# EAGLE board breakout (EAGLE 8.3.2), part 1 of 2
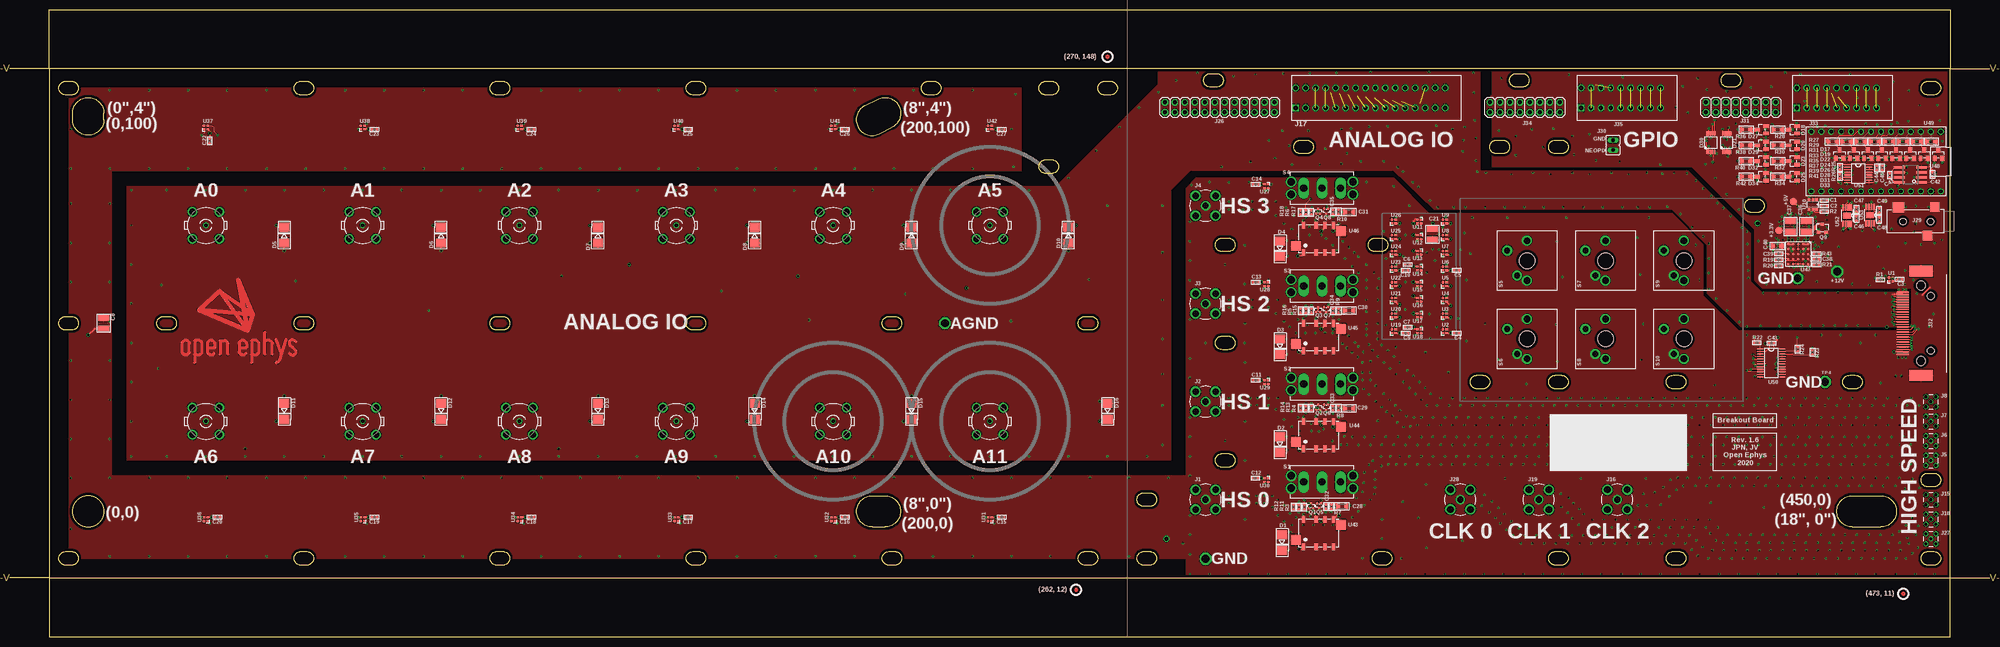
[diagram p5: board, top side]
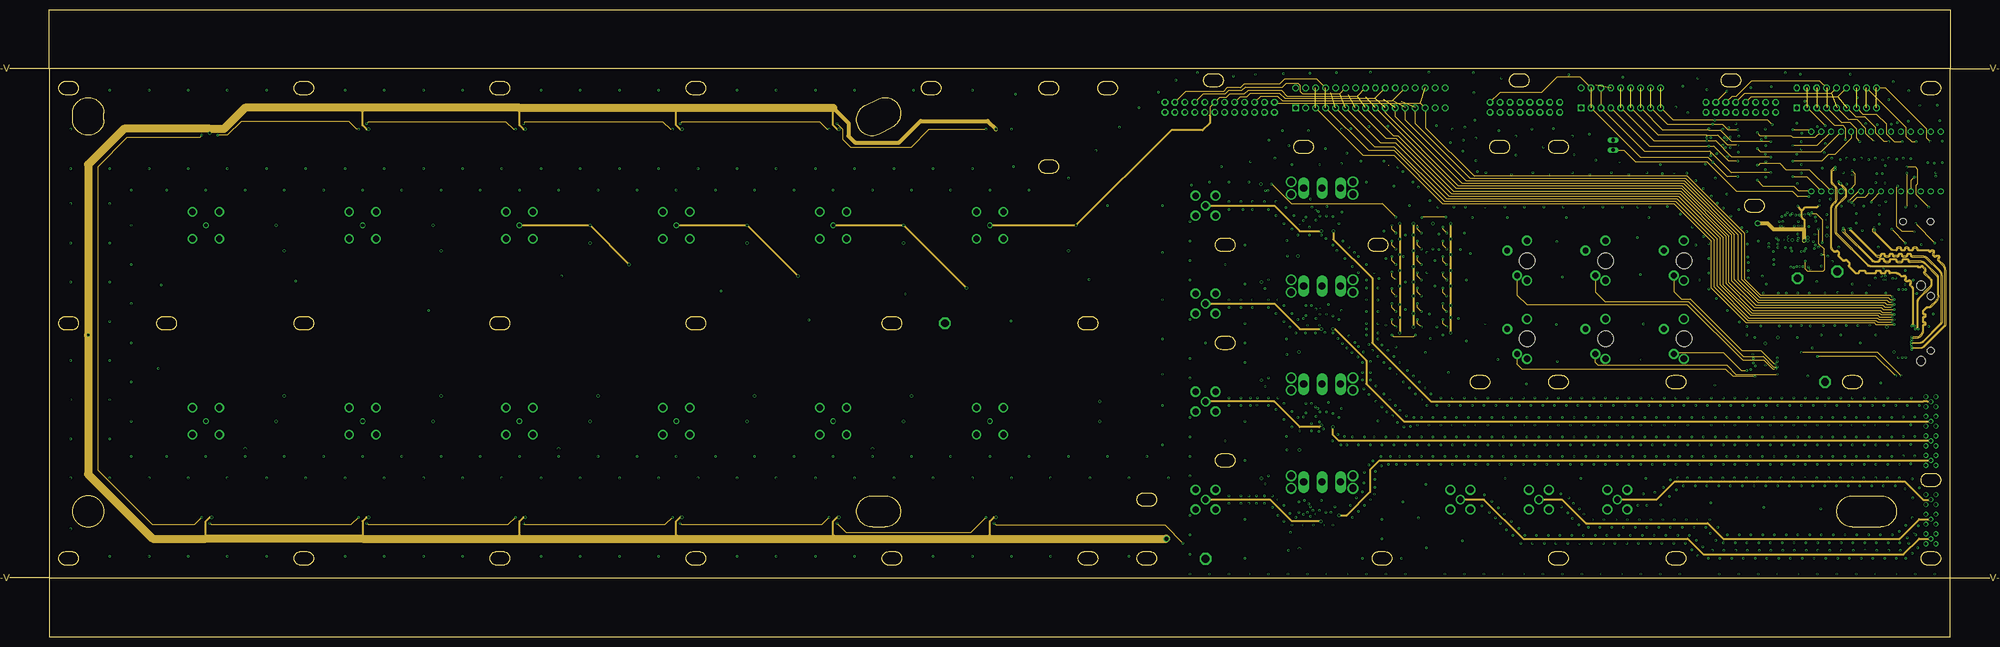
[diagram p6: board, inner layer HighSpeed]
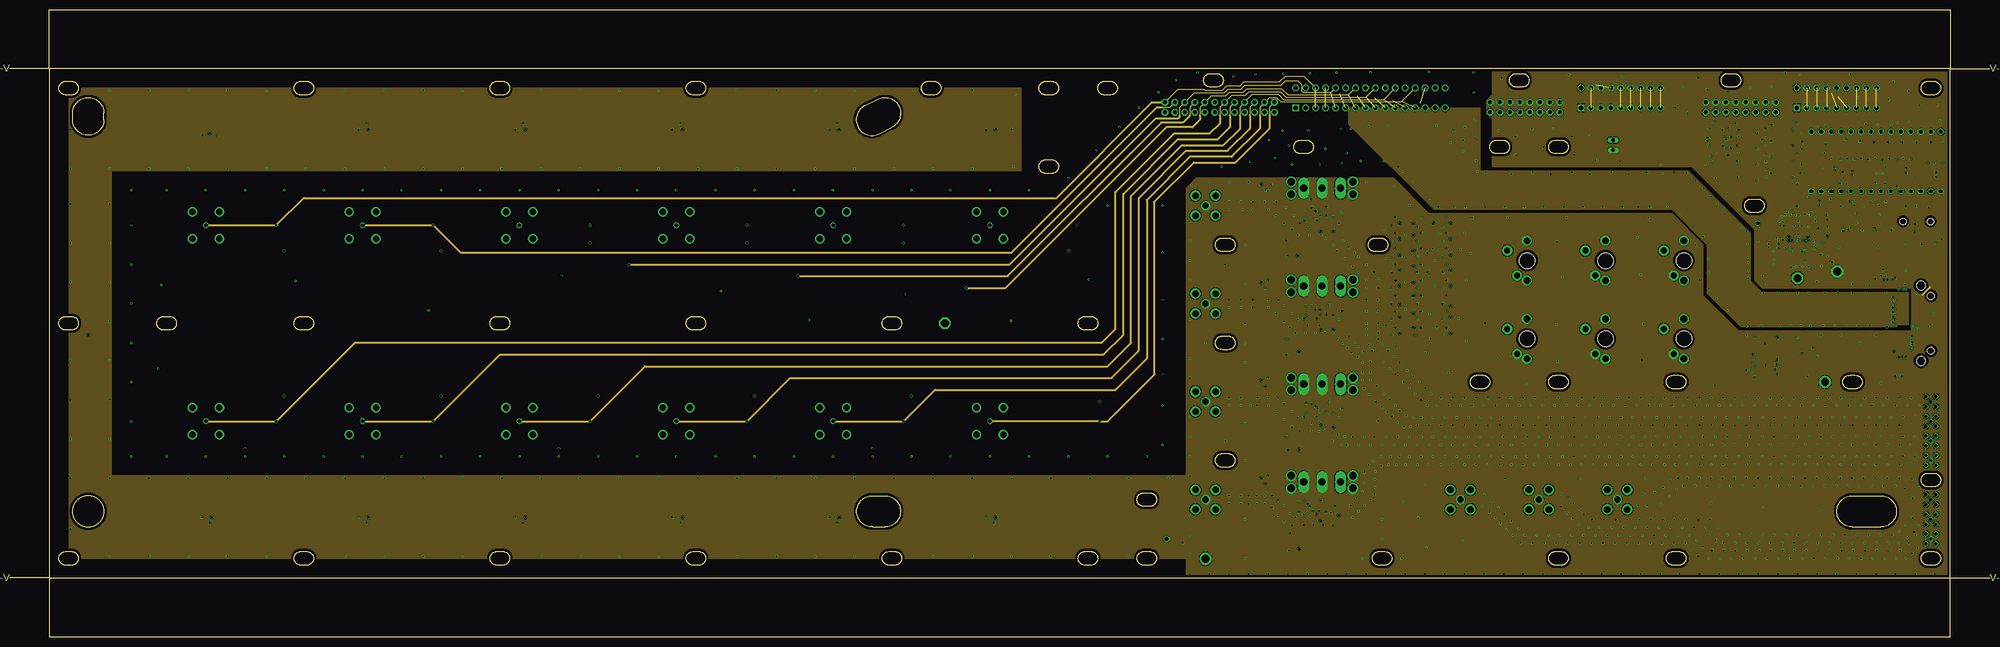
[diagram p7: board, inner layer GND2]
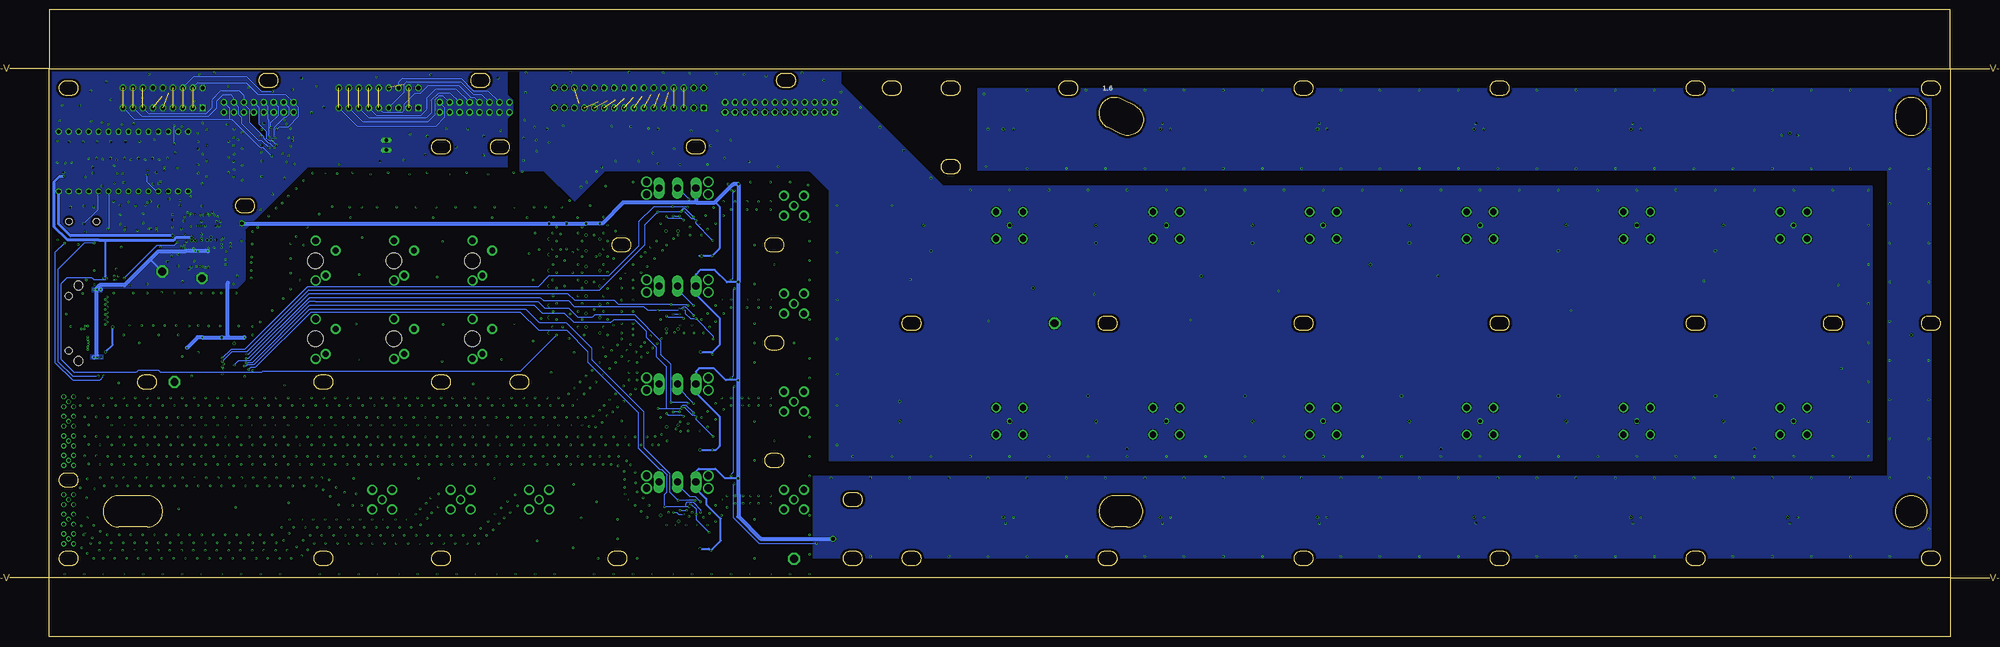
[diagram p8: board, bottom side, seen from below]

Size 505 x 160 mm. Coordinates in mm from the lower left corner, seen from the top.
Outline: 294 segments
Outline: circle at 20,32 radius 4
Copper layers (1+2*3+16): GND1 0.035mm / dielectric 0.2mm / HighSpeed 0.0175mm / dielectric 1.065mm / GND2 0.0356mm / dielectric 0.2007mm / LowSpeed 0.035mm
Design rules "jlcpcb-4-layer_JLC7628-stackup *": minimum track width 0.19mm, minimum drill 0.2mm, track to track 3.5mil, track to pad 0.1mm, pad to pad 0.1mm, via to via 0.1mm, smd to smd 0mil, copper to edge 0.7mm, drill to drill 5mil, minimum pad ring 4mil, minimum via ring 4mil, stop-mask expansion 3mil, vias tented up to drill 100mil, thermal gap 10mil
Net classes: 1 stripline: width 0.48 mm, drill 0.5 mm, clearance 0.1 mm; 3 100 Ohm Diff Mid: width 0.19 mm, drill 0.3 mm, clearance 0.09 mm
tKeepout: area 408.9,121 to 424.9,129

## Footprints (pad centres in the part's own frame; a part is rotated, then mirrored left to right if it is on the bottom)
0402 = smd 0.686 x 0.762: 1 -0.533,0; 2 0.533,0
1210 = smd 1.651 x 2.794: 1 -1.397,0; 2 1.397,0
0805 = smd 0.965 x 1.524: 1 -1.041,0; 2 1.041,0
SMA-DO214AC = smd 2.3 x 2.5: A -2,0; C 2,0
SOT23 = smd 1 x 1.4: 1 -0.95,-1.1; 2 0.95,-1.1; 3 0,1.1
MSOP-10-3X3 = smd 1.1 x 0.29: 1 -2.35,1; 2 -2.35,0.5; 3 -2.35,0; 4 -2.35,-0.5; 5 -2.35,-1; 6 2.35,-1; 7 2.35,-0.5; 8 2.35,0; 9 2.35,0.5; 10 2.35,1
SMA_JACK_142-0701-201 = drill 1.575: CLK 0,0 | drill 1.702: GND$1 -2.54,2.54; GND$2 2.54,2.54; GND$3 -2.54,-2.54; GND$4 2.54,-2.54
MMCX-THRU = drill 0.8: GND@1 -1.27,1.27; GND@2 -1.27,-1.27; GND@3 1.27,-1.27; GND@4 1.27,1.27; SIG 0,0
0731010360 = drill 0.9: 1 0,0 | drill 1.6: 2 3.43,3.43; 3 -3.43,3.43; 4 -3.43,-3.43; 5 3.43,-3.43
SCREW16-2 = drill 1.1 square: 1 0,0 | drill 1.1 octagon: 2 2.54,0; 3 5.08,0; 4 7.62,0; 5 10.16,0; 6 12.7,0; 7 15.24,0; 8 17.78,0; 9 20.32,0; 10 22.86,0; 11 25.4,0; 12 27.94,0; 13 30.48,0; 14 33.02,0; 15 35.56,0; 16 38.1,0; 17 0,5.08; 18 2.54,5.08; 19 5.08,5.08; 20 7.62,5.08; 21 10.16,5.08; 22 12.7,5.08; 23 15.24,5.08; 24 17.78,5.08; 25 20.32,5.08; 26 22.86,5.08; 27 25.4,5.08; 28 27.94,5.08; 29 30.48,5.08; 30 33.02,5.08; 31 35.56,5.08; 32 38.1,5.08
2X12-BIG = drill 1.016 pad 1.676 octagon: 1 -13.97,-1.17; 2 -13.97,1.37; 3 -11.43,-1.17; 4 -11.43,1.37; 5 -8.89,-1.17; 6 -8.89,1.37; 7 -6.35,-1.17; 8 -6.35,1.37; 9 -3.81,-1.17; 10 -3.81,1.37; 11 -1.27,-1.17; 12 -1.27,1.37; 13 1.27,-1.17; 14 1.27,1.37; 15 3.81,-1.17; 16 3.81,1.37; 17 6.35,-1.17; 18 6.35,1.37; 19 8.89,-1.17; 20 8.89,1.37; 21 11.43,-1.17; 22 11.43,1.37; 23 13.97,-1.17; 24 13.97,1.37
35RASMT2BHNTRX = smd 2.4 x 2.55: 1 0.8,3.675; 5 -1.1,-3.675 | smd 2.9 x 2.75: 4 8.2,-3.575 | hole 1.6: 0,0; 7,0
JP2 = drill 0.914 long: 1 0,0; 2 2.54,0
2X08-BIG = drill 1.016 pad 1.676 octagon: 1 -8.89,-1.17; 2 -8.89,1.37; 3 -6.35,-1.17; 4 -6.35,1.37; 5 -3.81,-1.17; 6 -3.81,1.37; 7 -1.27,-1.17; 8 -1.27,1.37; 9 1.27,-1.17; 10 1.27,1.37; 11 3.81,-1.17; 12 3.81,1.37; 13 6.35,-1.17; 14 6.35,1.37; 15 8.89,-1.17; 16 8.89,1.37
12226-82X0-00XX = smd 0.335 x 3: 1 7.938,7.2; 2 6.668,7.2; 3 5.397,7.2; 4 4.128,7.2; 5 2.857,7.2; 6 1.587,7.2; 7 0.318,7.2; 8 -0.953,7.2; 9 -2.223,7.2; 10 -3.493,7.2; 11 -4.763,7.2; 12 -6.032,7.2; 13 -7.303,7.2; 14 7.303,7.2; 15 6.032,7.2; 16 4.763,7.2; 17 3.493,7.2; 18 2.223,7.2; 19 0.953,7.2; 20 -0.318,7.2; 21 -1.587,7.2; 22 -2.857,7.2; 23 -4.128,7.2; 24 -5.397,7.2; 25 -6.668,7.2; 26 -7.938,7.2 | smd 2.8 x 6: PAD1 -13.3,2.5; PAD2 13.3,2.5 | hole 1.8: 7,0; -7,0 | hole 2.3: 9.6,2.5; -9.6,2.5
SCREW9-2 = drill 1.1 square: 1 0,0 | drill 1.1 octagon: 2 2.54,0; 3 5.08,0; 4 7.62,0; 5 10.16,0; 6 12.7,0; 7 15.24,0; 8 17.78,0; 9 20.32,0; 10 0,5.08; 11 2.54,5.08; 12 5.08,5.08; 13 7.62,5.08; 14 10.16,5.08; 15 12.7,5.08; 16 15.24,5.08; 17 17.78,5.08; 18 20.32,5.08
SC75 = smd 0.356 x 0.503: 1 -0.508,-0.65; 2 0.508,-0.65; 3 0,0.65
SOT23-GSD = smd 0.8 x 0.9: D 0,0; G -0.95,-2.1; S 0.95,-2.1
CK_7101J1V3QE2 = drill 1.85 long: 1 0,0 | drill 1.85 pad 2.54 long: 2 0,4.7; 3 0,-4.7 | drill 1.85: P$4 -1.59,7.875; P$5 1.59,7.875; P$6 -1.59,-7.875; P$7 1.59,-7.875
CHERRY-MX = drill 1.714 pad 1.93: P$3 -5.08,0; P$4 5.08,0 | drill 1.5 pad 2.54: SW1 -3.81,2.54; SW2 2.54,5.08 | hole 4: 0,0
TP19R = smd 1.9 x 1.9: TP 0,0
TESTPOINT_2MM = drill 2 octagon: 1 0,0
NEOPIXEL-1.5X1.5 = smd 0.55 x 0.55: 1 -0.475,-0.475; 2 0.475,-0.475; 3 0.475,0.475; 4 -0.475,0.475
SOT23-6 = smd 0.65 x 1.06: 1 -0.95,-1.1; 2 0,-1.1; 3 0.95,-1.1; 4 0.95,1.1; 5 0,1.1; 6 -0.95,1.1
G6KU-2F-RF = smd 0.8 x 1.8: 1 0,-3.5; 1X6 5.4,3.5; 2 3.2,-3.5; 3 5.4,-3.5; 4 7.6,-3.5; 5 7.6,3.5; 6 3.2,3.5; 7 0,3.5 | smd 2.5 x 2.5: CASE1 -1.95,-1.75; CASE2 9.55,2.05
BGA_5X5_625X625 = smd 0.635 x 0.635: A1 -2.54,2.54; A2 -1.27,2.54; A3 0,2.54; A4 1.27,2.54; A5 2.54,2.54; B1 -2.54,1.27; B2 -1.27,1.27; B3 0,1.27; B4 1.27,1.27; B5 2.54,1.27; C1 -2.54,0; C2 -1.27,0; C3 0,0; C4 1.27,0; C5 2.54,0; D1 -2.54,-1.27; D2 -1.27,-1.27; D3 0,-1.27; D4 1.27,-1.27; D5 2.54,-1.27; E1 -2.54,-2.54; E2 -1.27,-2.54; E3 0,-2.54; E4 1.27,-2.54; E5 2.54,-2.54
SO-08 = smd 0.6 x 2.708: 1 -1.905,-2.854; 2 -0.635,-2.854; 3 0.635,-2.854; 4 1.905,-2.854; 5 1.905,2.854; 6 0.635,2.854; 7 -0.635,2.854; 8 -1.905,2.854
TINY-FPGA-BX_BASIC = drill 0.965: 1 -7.62,13.97; 2 -7.62,11.43; 3 -7.62,8.89; 3.3V 7.62,11.43; 4 -7.62,6.35; 5 -7.62,3.81; 6 -7.62,1.27; 7 -7.62,-1.27; 8 -7.62,-3.81; 9 -7.62,-6.35; 10 -7.62,-8.89; 11 -7.62,-11.43; 12 -7.62,-13.97; 13 -7.62,-16.51; 14 7.62,-16.51; 15 7.62,-13.97; 16 7.62,-11.43; 17 7.62,-8.89; 18 7.62,-6.35; 19 7.62,-3.81; 20 7.62,-1.27; 21 7.62,1.27; 22 7.62,3.81; 23 7.62,6.35; 24 7.62,8.89; GND@1 -7.62,16.51; GND@2 7.62,13.97; VIN 7.62,16.51
TSSOP-24 = smd 1.6 x 0.3: 1 -2.8,3.575; 2 -2.8,2.925; 3 -2.8,2.275; 4 -2.8,1.625; 5 -2.8,0.975; 6 -2.8,0.325; 7 -2.8,-0.325; 8 -2.8,-0.975; 9 -2.8,-1.625; 10 -2.8,-2.275; 11 -2.8,-2.925; 12 -2.8,-3.575; 13 2.8,-3.575; 14 2.8,-2.925; 15 2.8,-2.275; 16 2.8,-1.625; 17 2.8,-0.975; 18 2.8,-0.325; 19 2.8,0.325; 20 2.8,0.975; 21 2.8,1.625; 22 2.8,2.275; 23 2.8,2.925; 24 2.8,3.575
TSSOP-16 = smd 1.6 x 0.3: 1 -2.8,2.275; 2 -2.8,1.625; 3 -2.8,0.975; 4 -2.8,0.325; 5 -2.8,-0.325; 6 -2.8,-0.975; 7 -2.8,-1.625; 8 -2.8,-2.275; 9 2.8,-2.275; 10 2.8,-1.625; 11 2.8,-0.975; 12 2.8,-0.325; 13 2.8,0.325; 14 2.8,0.975; 15 2.8,1.625; 16 2.8,2.275
MSOP-8-PAD-3X3 = smd 1.6 x 0.4: 1 -2.1,0.975; 2 -2.1,0.325; 3 -2.1,-0.325; 4 -2.1,-0.975; 5 2.1,-0.975; 6 2.1,-0.325; 7 2.1,0.325; 8 2.1,0.975 | smd 1.57 x 1.89: PAD 0,0

## Placement (x,y rotation side)
C1  0.1uF  [0402]  462.8,111.3 0 top
C2  0.1uF  [0402]  462.8,109.9 0 top
C3  0.1uF  [0402]  482,91.2 180 top
C4  0.1uF  [0402]  369,77.5 180 top
C5  0.1uF  [0402]  369,93.5 180 top
C6  0.1uF  [0402]  356.5,95 0 top
C7  0.1uF  [0402]  356.5,79 0 top
C8  47uF  [1210]  24,80 270 top
C9  0.1uF  [0402]  356,77.5 180 top
C10  0.1uF  [0402]  356,93.5 180 top
C11  0.1uF  [0402]  317.8,65.5 0 top
C12  0.1uF  [0402]  317.7,40.5 0 top
C13  0.1uF  [0402]  317.8,90.5 0 top
C14  0.1uF  [0402]  317.8,115.5 0 top
C15  0.1uF  [0402]  253,30.5 180 top
C16  0.1uF  [0402]  213,30.5 180 top
C17  0.1uF  [0402]  173,30.5 180 top
C18  0.1uF  [0402]  133,30.5 180 top
C19  0.1uF  [0402]  93,30.5 180 top
C20  0.1uF  [0402]  53,30.5 180 top
C21  47uF  [1210]  362.9,102.7 90 top
C22  0.1uF  [0402]  51,126.5 90 top
C23  0.1uF  [0402]  93,129.5 180 top
C24  0.1uF  [0402]  133,129.5 180 top
C25  0.1uF  [0402]  173,129.5 180 top
C26  0.1uF  [0402]  213,129.5 180 top
C27  0.1uF  [0402]  253,129.5 180 top
C28  10uF  [0805]  339.8,33.3 180 top
C29  10uF  [0805]  341.6,58.3 180 top
C30  10uF  [0805]  341.6,83.2 180 top
C31  10uF  [0805]  341.6,108.4 180 top
C32  47nF  [0402]  335.7,33.2 270 top
C33  47nF  [0402]  337.5,58.3 270 top
C34  47nF  [0402]  337.5,83.2 270 top
C35  47nF  [0402]  337.5,108.4 270 top
C36  47uF  [1210]  458.2,104.7 270 top
C37  47uF  [1210]  454.2,104.7 270 top
C38  0.1uF  [0402]  460.8,96.3 180 top
C39  0.1uF  [0402]  451.2,97.7 0 top
C40  10uF  [0805]  450.8,99.7 0 top
C41  0.1uF  [0402]  479.5,117.8 90 top
C42  0.1uF  [0402]  490.4,118 270 top
C43  0.1uF  [0402]  449.4,74.9 0 top
C44  4.7nF  [0402]  476.2,119.7 270 top
C45  0.1uF  [0402]  477.6,119.7 270 top
C46  4.7nF  [0402]  471,106.8 270 top
C47  0.1uF  [0402]  471,109.1 90 top
C48  4.7nF  [0402]  476.8,106.5 270 top
C49  0.1uF  [0402]  476.8,108.8 90 top
D1  S1GTR  [SMA-DO214AC]  324.5,24 270 top
D2  S1GTR  [SMA-DO214AC]  324,49 270 top
D3  S1GTR  [SMA-DO214AC]  324,74 270 top
D4  S1GTR  [SMA-DO214AC]  324,99 270 top
D5  P6SMB18CA  [SMA-DO214AC]  70,102.5 90 top
D6  P6SMB18CA  [SMA-DO214AC]  110,102.5 90 top
D7  P6SMB18CA  [SMA-DO214AC]  150,102.5 90 top
D8  P6SMB18CA  [SMA-DO214AC]  190,102.5 90 top
D9  P6SMB18CA  [SMA-DO214AC]  230,102.5 90 top
D10  P6SMB18CA  [SMA-DO214AC]  270,102.5 90 top
D11  P6SMB18CA  [SMA-DO214AC]  70,57.5 270 top
D12  P6SMB18CA  [SMA-DO214AC]  110,57.5 270 top
D13  P6SMB18CA  [SMA-DO214AC]  150,57.5 270 top
D14  P6SMB18CA  [SMA-DO214AC]  190,57.5 270 top
D15  P6SMB18CA  [SMA-DO214AC]  230,57.5 270 top
D16  P6SMB18CA  [SMA-DO214AC]  280,57.5 270 top
D17  BAT54SLT1G  [SOT23]  466.7,123.2 0 top
D18  BAT54SLT1G  [SOT23]  454.8,129.4 90 top
D19  BAT54SLT1G  [SOT23]  470.3,123.2 0 top
D20  BAT54SLT1G  [SOT23]  454.8,125.4 90 top
D21  CM1213−08MR  [MSOP-10-3X3]  437.9,126.1 90 top
D22  BAT54SLT1G  [SOT23]  473.9,123.2 0 top
D23  BAT54SLT1G  [SOT23]  454.8,121.4 90 top
D24  BAT54SLT1G  [SOT23]  477.5,123.2 0 top
D25  BAT54SLT1G  [SOT23]  454.8,117.4 90 top
D26  BAT54SLT1G  [SOT23]  481.1,123.2 0 top
D27  BAT54SLT1G  [SOT23]  446.8,129.4 90 top
D28  BAT54SLT1G  [SOT23]  484.7,123.2 0 top
D29  BAT54SLT1G  [SOT23]  446.8,125.4 90 top
D30  CM1213−08MR  [MSOP-10-3X3]  433.9,126.1 90 top
D31  BAT54SLT1G  [SOT23]  488.3,123.2 0 top
D32  BAT54SLT1G  [SOT23]  446.8,121.4 90 top
D33  BAT54SLT1G  [SOT23]  491.9,123.2 0 top
D34  BAT54SLT1G  [SOT23]  446.8,117.4 90 top
E$1  [FIDUCIAL]  483,11 0 top
E$3  [FIDUCIAL]  272,12 0 top
E$5  [FIDUCIAL]  280,148 0 top
J1  [SMA_JACK_142-0701-201]  305,35 0 top
J2  [SMA_JACK_142-0701-201]  305,60 0 top
J3  [SMA_JACK_142-0701-201]  305,85 0 top
J4  [SMA_JACK_142-0701-201]  305,110 0 top
J5  [MMCX-THRU]  490,45 0 top
J6  [MMCX-THRU]  490,50 0 top
J7  [MMCX-THRU]  490,55 0 top
J8  [MMCX-THRU]  490,60 0 top
J9  [0731010360]  50,105 0 top
J10  [0731010360]  90,105 0 top
J11  [0731010360]  130,105 0 top
J12  [0731010360]  170,105 0 top
J13  [0731010360]  210,105 0 top
J14  [0731010360]  250,105 0 top
J15  [MMCX-THRU]  490,35 0 top
J16  [SMA_JACK_142-0701-201]  410,35 0 top
J17  1789074  [SCREW16-2]  328,135 0 top
J18  [MMCX-THRU]  490,30 0 top
J19  [SMA_JACK_142-0701-201]  390,35 0 top
J20  [0731010360]  50,55 0 top
J21  [0731010360]  90,55 0 top
J22  [0731010360]  130,55 0 top
J23  [0731010360]  170,55 0 top
J24  [0731010360]  210,55 0 top
J25  [0731010360]  250,55 0 top
J26  69168-124HLF  [2X12-BIG]  308.6,135 0 top
J27  [MMCX-THRU]  490,25 0 top
J28  [SMA_JACK_142-0701-201]  370,35 0 top
J29  SJ1-3514-SMT-TR  [35RASMT2BHNTRX]  489.9,106 180 top
J30  [JP2]  408.9,124.2 90 top
J31  69168-116HLF  [2X08-BIG]  441.5,135 0 top
J32  12226-8250-00FR  [12226-82X0-00XX]  490,80 90 top
J33  1888276  [SCREW9-2]  455.8,135 0 top
J34  69168-116HLF  [2X08-BIG]  386.45,135 0 top
J35  1888276  [SCREW9-2]  400.75,135 0 top
Q1  SI1012R  [SC75]  331.9,33.4 0 top
Q2  SI1012R  [SC75]  333.7,58.6 0 top
Q3  SI1012R  [SC75]  333.7,83.5 0 top
Q4  SI1012R  [SC75]  333.7,108.6 0 top
Q5  SI1012R  [SC75]  334,33.4 180 top
Q6  SI1012R  [SC75]  335.8,58.6 180 top
Q7  SI1012R  [SC75]  335.8,83.5 180 top
Q8  SI1012R  [SC75]  335.8,108.6 180 top
Q9  IRFML8244TRPBF  [SOT23-GSD]  462.3,105.3 0 top
R1  500  [0402]  477.1,91.1 0 top
R2  4.7k  [0402]  462.8,108.5 180 top
R3  1k  [0402]  328.8,33.1 270 top
R4  1k  [0402]  330.6,58.3 90 top
R5  1k  [0402]  330.6,83.2 90 top
R6  1k  [0402]  330.6,108.3 90 top
R7  49.9  [0402]  337.1,33.2 270 top
R8  49.9  [0402]  338.9,58.3 270 top
R9  49.9  [0402]  338.9,83.2 270 top
R10  49.9  [0402]  338.9,108.4 270 top
R11  1k  [0402]  330.2,33.1 90 top
R12  100k  [0402]  327.4,33.1 90 top
R13  1k  [0402]  332,58.3 90 top
R14  100k  [0402]  329.2,58.3 90 top
R15  1k  [0402]  332,83.2 90 top
R16  100k  [0402]  329.2,83.2 90 top
R17  1k  [0402]  332,108.3 90 top
R18  100k  [0402]  329.2,108.3 90 top
R19  13.3k  [0402]  451.2,96.2 180 top
R20  649k  [0402]  451.2,94.7 180 top
R21  8.25k  [0402]  460.8,94.9 0 top
R22  4.7k  [0402]  445.6,75 0 top
R23  4.7k  [0402]  459.8,72.6 270 top
R24  4.7k  [0402]  456,73.4 270 top
R25  100  [0402]  466.8,119.8 270 top
R26  100  [0402]  466.8,117.5 90 top
R27  270, 0.5W  [0805]  464.9,126.3 180 top
R28  270, 0.5W  [0805]  450.9,129.4 180 top
R29  270, 0.5W  [0805]  468.5,126.3 180 top
R30  270, 0.5W  [0805]  450.9,125.4 180 top
R31  270, 0.5W  [0805]  472.1,126.3 180 top
R32  270, 0.5W  [0805]  450.9,121.4 180 top
R33  270, 0.5W  [0805]  475.7,126.3 180 top
R34  270, 0.5W  [0805]  450.9,117.4 180 top
R35  270, 0.5W  [0805]  479.3,126.3 180 top
R36  270, 0.5W  [0805]  442.9,129.4 180 top
R37  270, 0.5W  [0805]  482.9,126.3 180 top
R38  270, 0.5W  [0805]  442.9,125.4 180 top
R39  270, 0.5W  [0805]  486.5,126.3 180 top
R40  270, 0.5W  [0805]  442.9,121.4 180 top
R41  270, 0.5W  [0805]  490.1,126.3 180 top
R42  270, 0.5W  [0805]  442.9,117.4 180 top
R43  4.7k  [0402]  460.8,97.7 180 top
S1  7101J1V3BE2  [CK_7101J1V3QE2]  334.7,39.5 270 top
S2  7101J1V3BE2  [CK_7101J1V3QE2]  334.7,64.5 270 top
S3  7101J1V3BE2  [CK_7101J1V3QE2]  334.7,89.5 270 top
S4  7101J1V3BE2  [CK_7101J1V3QE2]  334.7,114.5 270 top
S5  CHERRY-MX  [CHERRY-MX]  387,96 90 top
S6  CHERRY-MX  [CHERRY-MX]  387,76 90 top
S7  CHERRY-MX  [CHERRY-MX]  407,96 90 top
S8  CHERRY-MX  [CHERRY-MX]  407,76 90 top
S9  CHERRY-MX  [CHERRY-MX]  427,96 90 top
S10  CHERRY-MX  [CHERRY-MX]  427,76 90 top
TP1  [TP19R]  451.2,103.6 270 top
TP2  [TP19R]  454.9,111 270 top
TP3  [TESTPOINT_2MM]  456,91.5 0 top
TP4  [TESTPOINT_2MM]  463,65 0 top
TP5  [TESTPOINT_2MM]  305,19.9 0 top
TP6  [TESTPOINT_2MM]  238.5,80 0 top
TP7  [TESTPOINT_2MM]  466.1,93.2 0 top
U1  SK6805-E-J  [NEOPIXEL-1.5X1.5]  479.8,91.2 0 top
U2  SK6805-E-J  [NEOPIXEL-1.5X1.5]  366,78 0 top
U3  SK6805-E-J  [NEOPIXEL-1.5X1.5]  366,82 0 top
U4  SK6805-E-J  [NEOPIXEL-1.5X1.5]  366,86 0 top
U5  SK6805-E-J  [NEOPIXEL-1.5X1.5]  366,90 0 top
U6  SK6805-E-J  [NEOPIXEL-1.5X1.5]  366,94 0 top
U7  SK6805-E-J  [NEOPIXEL-1.5X1.5]  366,98 0 top
U8  SK6805-E-J  [NEOPIXEL-1.5X1.5]  366,102 0 top
U9  SK6805-E-J  [NEOPIXEL-1.5X1.5]  366,106 0 top
U10  TXB0101  [SOT23-6]  459.9,110.3 180 top
U11  SK6805-E-J  [NEOPIXEL-1.5X1.5]  359.5,106 180 top
U12  SK6805-E-J  [NEOPIXEL-1.5X1.5]  359.5,102 180 top
U13  SK6805-E-J  [NEOPIXEL-1.5X1.5]  359.5,98 180 top
U14  SK6805-E-J  [NEOPIXEL-1.5X1.5]  359.5,94 180 top
U15  SK6805-E-J  [NEOPIXEL-1.5X1.5]  359.5,90 180 top
U16  SK6805-E-J  [NEOPIXEL-1.5X1.5]  359.5,86 180 top
U17  SK6805-E-J  [NEOPIXEL-1.5X1.5]  359.5,82 180 top
U18  SK6805-E-J  [NEOPIXEL-1.5X1.5]  359.5,78 180 top
U19  SK6805-E-J  [NEOPIXEL-1.5X1.5]  353,78 0 top
U20  SK6805-E-J  [NEOPIXEL-1.5X1.5]  353,82 0 top
U21  SK6805-E-J  [NEOPIXEL-1.5X1.5]  353,86 0 top
U22  SK6805-E-J  [NEOPIXEL-1.5X1.5]  353,90 0 top
U23  SK6805-E-J  [NEOPIXEL-1.5X1.5]  353,94 0 top
U24  SK6805-E-J  [NEOPIXEL-1.5X1.5]  353,98 0 top
U25  SK6805-E-J  [NEOPIXEL-1.5X1.5]  353,102 0 top
U26  SK6805-E-J  [NEOPIXEL-1.5X1.5]  353,106 0 top
U27  SK6805-E-J  [NEOPIXEL-1.5X1.5]  320.5,115 180 top
U28  SK6805-E-J  [NEOPIXEL-1.5X1.5]  320.5,90 180 top
U29  SK6805-E-J  [NEOPIXEL-1.5X1.5]  320.5,65 180 top
U30  SK6805-E-J  [NEOPIXEL-1.5X1.5]  320.5,40 180 top
U31  SK6805-E-J  [NEOPIXEL-1.5X1.5]  250,30 90 top
U32  SK6805-E-J  [NEOPIXEL-1.5X1.5]  210,30 90 top
U33  SK6805-E-J  [NEOPIXEL-1.5X1.5]  170,30 90 top
U34  SK6805-E-J  [NEOPIXEL-1.5X1.5]  130,30 90 top
U35  SK6805-E-J  [NEOPIXEL-1.5X1.5]  90,30 90 top
U36  SK6805-E-J  [NEOPIXEL-1.5X1.5]  50,30 90 top
U37  SK6805-E-J  [NEOPIXEL-1.5X1.5]  50,130 0 top
U38  SK6805-E-J  [NEOPIXEL-1.5X1.5]  90,130 0 top
U39  SK6805-E-J  [NEOPIXEL-1.5X1.5]  130,130 0 top
U40  SK6805-E-J  [NEOPIXEL-1.5X1.5]  170,130 0 top
U41  SK6805-E-J  [NEOPIXEL-1.5X1.5]  210,130 0 top
U42  SK6805-E-J  [NEOPIXEL-1.5X1.5]  250,130 0 top
U43  G6K-2F-RF  [G6KU-2F-RF]  330,26.5 0 top
U44  G6K-2F-RF  [G6KU-2F-RF]  330,51.5 0 top
U45  G6K-2F-RF  [G6KU-2F-RF]  330,76.5 0 top
U46  G6K-2F-RF  [G6KU-2F-RF]  330,101.5 0 top
U47  LTM4622A  [BGA_5X5_625X625]  456.2,97.7 270 top
U48  SI8610  [SO-08]  484.8,117.9 90 top
U49  TINY-FPGA-BX  [TINY-FPGA-BX_BASIC]  476,121.3 270 top
U50  TCA9555  [TSSOP-24]  449.3,69.9 0 top
U51  FIN1032MTCX  [TSSOP-16]  471.5,118.2 0 top
U52  SN65LVDS9638DGN  [MSOP-8-PAD-3X3]  468.6,107.5 270 top
U53  SN65LVDS9638DGN  [MSOP-8-PAD-3X3]  474.5,107.6 270 top
X  OE-LOGO_28X20  [OE-LOGO-28X20]  57.1,77.4 0 top

## Tracks (layer width: path | path; a pad name or v marks a point on that pad's centre or on a via)
!TCA_INT
  GND1 0.2: U50.1 446.5,74.63 R22.2
+3V3  (via drill 0.3, 0.5)
  GND1 0.2: R22.1 445.1,75.03 v445.1,76.4 | U50.24 450.43,73.47 449.9,74 449.9,74.87 C43.2 | R24.1 455.9,74.03 v455.9,76.4 | R23.1 v459.8,73.72 | U51.4 467.62,118.53 v467.6,118.5 | D18.2 455.8,130.25 v455.8,131.1 | v455.8,123.2 455.8,122.35 D23.2 | D25.2 455.8,118.35 455.85,118.3 v456.9,118.3 | v447.8,119.25 447.8,118.2 447.9,118.2 D34.2 | v447.8,123.2 447.8,122.35 D32.2 | D29.2 447.8,126.35 447.25,126.9 v446.8,126.9 | v447.8,129.6 447.8,130.35 D27.2 | v484.9,122 485.55,122 arc90 D28.2 | v481.3,121.9 481.85,121.9 arc90 D26.2 | v477.7,121.7 478.05,121.7 arc90 D24.2 | v474.1,121.8 474.5,121.8 arc90 474.9,122.2 474.9,122.15 arc-90 D22.2 | v470.5,121.8 471.1,121.8 arc90 471.4,122.1 D19.2 | v466.9,121.8 467.35,121.8 arc90 D17.2 | TP1.TP 454.2,103.6 C37.2 | D31.2 489.25,121.05 v489.2,121 | D33.2 492.85,121.05 v492.9,121 | D30.8 v433.9,127.4 | U10.1 461.5,111.4 v461.6,111.3 C1.1 | R2.1 463.33,107.77 v463.4,107.7 | v457,126.34 D20.2 | D21.8 v437.9,126.9
  GND1 0.3: U51.16 475.96,120.47 C44.1 | C44.1 C45.1 477.63,120.2 v478.4,120.2 | C44.1 476.3,120.33 | C48.1 v476.8,107.7 C49.1 475.95,108.27 475.48,108.75 U53.1 | 471,108.5 C47.1 | 471,108.5 v471,108 C46.1 | U52.1 470.68,108.5 471,108.5
  GND1 0.5: C37.2 454.1,103.2 | C43.2 450.9,75.87 v450.9,76.4
  GND1 0.508: U47.E1 U47.D1
  LowSpeed 0.2: 445.1,76.45 v445.1,76.4
  LowSpeed 1: 449.1,76.4 v445.1,76.4 | v459.8,73.72 457.12,76.4 v455.9,76.4 v450.9,76.4 449.1,76.4 | 449.1,76.4 449.4,76.7 449.4,90.3
  other vias: 453.7,101.2 454.6,101.2 453.7,102
  pour GND1 (rank 2, no thermals): 453.2,103.7 453.2,99.7 455.2,99.7 455.2,103.7
  pour LowSpeed (rank 3): 378,120 378,132.4 376.6,133.7 376.6,136.8 378,138.2 378,148.1 503,148.1 503,89 447,89 445,91 445,104 429,120
+5V0  (via drill 0.3, 0.5, 1)
  GND1 0.2: C3.2 480.99,90.72 U1.2 | 330.1,23.1 U43.1 329.82,22.82 | D1.C 326.16,22 v326.18,22.02 | 330.1,48.1 U44.1 | 324.1,71.9 D3.C v325.7,72 | 330.21,72.79 U45.1 | 324.06,96.94 D4.C 324.2,97.2 v325.9,97.2 | D2.C 324.7,47.7 v325.8,47.7 | U10.6 460.85,109.45 v461.5,110.1 462.07,110.1 C2.1
  GND1 0.3: U48.1 489.8,116 490.4,116.6 C42.2
  GND1 0.406: C19.2 92.44,30.48 v91.5,30.48 | C20.2 52.44,30.48 v51.5,30.48
  GND1 0.5: 458.3,103.2 C36.2 458.6,103.3 | C42.2 491.25,117.47 v491.28,117.5 | C21.2 362.9,105.4 v363,105.5 | U24.2 354.48,97.53 v354.5,97.5 | U25.2 354.48,101.53 v354.5,101.5 | U26.2 354.48,105.53 v354.5,105.5 | U19.2 354.48,77.53 v354.5,77.5 C9.2 | U11.2 358.48,106.47 358,106 v358,105.5 | U9.2 367.5,105.53 v367.5,105.5 | U17.2 358,82.47 v358,82.5 | C7.2 v358,79 358.52,78.47 U18.2 | U8.2 367.5,101.53 v367.5,101.5 | U7.2 367.5,97.53 v367.5,97.5 | U6.2 367.5,93.53 v367.5,93.5 C5.2 | U5.2 367.5,89.53 v367.5,89.5 | U4.2 v367.5,84.5 | U3.2 367.48,81.53 v367.5,81.5 | U2.2 367.48,77.53 v367.5,77.5 C4.2 | U27.2 320,115.5 v319.17,115.5 C14.2 | C13.2 318.36,90.47 v319.2,90.47 U28.2 | U29.2 v319.2,65.47 319.18,65.5 C11.2 | U30.2 v319.2,40.48 319.18,40.5 C12.2 | v51.5,30.48 U36.2 | v91.5,30.48 U35.2 | U34.2 v131.5,30.48 131.53,30.5 C18.2 | U33.2 v171.5,30.48 172.44,30.48 C17.2 | U32.2 v211.5,30.48 212.44,30.48 C16.2 | U31.2 v251.5,30.48 252.44,30.48 C15.2 | C22.2 v51,128.5 51,129 U37.2 | C23.2 v91.5,129.5 90.5,129.5 U38.2 | C24.2 v131.5,129.5 130.5,129.5 U39.2 | C25.2 v171.5,129.5 170.5,129.5 arc-90 U40.2 | C26.2 v211.5,129.5 210.5,129.5 U41.2 | C8.2 21.6,78.6 v20,77 | U42.2 251.5,129.53 | 251.5,129.53 252.44,129.53 C27.2 | 251.5,129.53 v251.5,129.5 | v354.5,84.8 354.2,84.8 U21.2 | v354.5,81.5 353.5,81.5 U20.2 | v354.5,89.5 353.5,89.5 U22.2 | U23.2 354.48,93.53 v354.5,93.5 C10.2 | U15.2 358.02,90.47 v358,90.5 | U16.2 358.52,86.47 v358,87 | U14.2 358.02,94.47 v358,94.5 357.53,94.5 C6.2 | U13.2 358.02,98.47 v358,98.5 | U12.2 358.02,102.47 v358,102.5 | C3.2 481.4,91.2 v481,91.6 | U46.1 330,97.7 329.5,97.2 v328.5,97.2 | U45.1 330,72.7 v328.8,72.7
  GND1 0.5: U44.1 329.2,48 v328.9,47.7 | v328.9,22.5 330,22.5 U43.1 | v456,109.9 TP2.TP
  GND1 0.508: U47.B1 U47.A1
  GND1 0.8: Q9.D 461,105.3 460.3,104.6 460.3,104 459.6,103.3 C36.2
  HighSpeed 0.5: 250,25 250,29.5 250.97,30.48 v251.5,30.48 | v211.5,30.48 211.5,30.5 211,30.5 210,29.5 210,25 | 170,25 170,29.5 171,30.5 171.5,30.5 v171.5,30.48 | 130,25 130,29.5 131,30.5 131.5,30.5 v131.5,30.48 | v91.5,30.48 91.47,30.5 91,30.5 90,29.5 90,25 | 50,25 50,29.5 51,30.5 51.48,30.5 v51.5,30.48 | 51,129.5 v51,128.5 51,129.65 | v91.5,129.5 91,129.5 90,130.5 90,135 | v131.5,129.5 131,129.5 130,130.5 130,135 | v171.5,129.5 171,129.5 170,130.5 170,135 | v211.5,129.5 211,129.5 210,130.5 210,135 | v367.5,105.5 v367.5,101.5 v367.5,97.5 v367.5,93.5 v367.5,89.5 v367.5,84.5 v367.5,81.5 v367.5,77.5 | v354.5,105.5 v354.5,101.5 v354.5,97.5 v354.5,93.5 v354.5,89.5 v354.5,84.8 v354.5,81.5 v354.5,77.5 | v358,105.5 v358,102.5 v358,98.5 v358,94.5 v358,90.5 v358,87 v358,82.5 v358,79 | 457.78,103.21 457.7,103.13 | 457.7,103.97 arc90 457.78,104.05 457.78,106.32 457.1,107 457.1,108.7 457.3,108.9 | 457.3,108.9 458,109.6 461,109.6 v461.5,110.1 | 457.3,108.9 457,108.9 v456,109.9
  HighSpeed 1: v445.8,105.5 448.4,105.5 449.93,103.97 457.7,103.97 457.7,103.13 v457.7,101.1 | v251.5,129.5 249.4,131.6 232.3,131.6 226.8,126.1 215.6,126.1 213.9,127.8 213.9,131.1 210,135
  HighSpeed 2: v295,25 250,25 210,25 170,25 130,25 90,25 50,25 36.5,25 20,41.5 v20,77 20,120.5 29.15,129.65 51,129.65 54.65,129.65 60,135 90,135 130,135 170,135 210,135
  LowSpeed 0.2: v325.7,72 325.7,72.7
  LowSpeed 0.5: v481,91.6 480.63,91.97 480.63,101.17 | v319.2,40.48 322.57,40.48 325,42.9 329.3,42.9 330,42.2 S1.3 330,37.8 327.4,35.2 327.4,33.8 323.7,30.1 323.7,24.5 v326.18,22.02 326.66,22.5 v328.9,22.5 | v319.2,65.47 322.38,65.47 325.4,68.5 329.2,68.5 330,67.7 S2.3 330,62.2 324,56.2 324,48.6 324.9,47.7 v325.8,47.7 v328.9,47.7 | v319.2,90.47 322.07,90.47 325.2,93.6 328.9,93.6 330,92.5 S3.3 330,87.4 324,81.4 324,74.4 325.7,72.7 v328.8,72.7 | 329.1,97.2 v328.5,97.2 v325.9,97.2 324,99.1 324,109.8 325.1,110.89
  LowSpeed 0.8: v458.6,101.9 462.5,101.9 463.23,101.17 480.63,101.17 482.2,101.17 482.28,101.25 490.25,101.25 493.73,104.73 493.73,116.07 492.3,117.5 v491.28,117.5
  LowSpeed 1: v445.8,105.5 v367.5,105.5 v363,105.5 v358,105.5 v354.5,105.5 353.83,105.5 348.53,110.8 330,110.8 | v295,25 313.5,25 319.17,30.67 319.17,36.34 319.2,36.37 v319.2,40.48 v319.2,65.47 v319.2,90.47 319.17,90.5 v319.17,115.5 320.5,115.5 325.1,110.89 325.2,110.8 330,110.8 | S4.3 330,110.8
  other vias: 458.6,101.1
  pour GND1 (rank 2, no thermals): 457.2,99.7 457.2,103.7 459.2,103.7 459.2,99.7
+5V0_GOOD  (via drill 0.3)
  GND1 0.2: v457.99,95.91 U47.B4 | Q9.G 461.3,103.25 v461.3,104.1 | R43.1 461.33,97.5 v462,97.5
  HighSpeed 0.2: v461.3,104.1 461.3,100.4 462.8,98.9 462.8,97.5 | 462.8,97.5 462.8,93.6 462.4,93.2 458.6,93.2 457.99,93.81 v457.99,95.91 | v462,97.5 462.8,97.5
+12V  (via drill 0.3, 0.35)
  GND1 0.2: R43.2 460.3,97.73 v460.3,99.1
  LowSpeed 0.2: v460.3,99.1 460.3,98.4 460.2,98.4
  LowSpeed 0.5: TP7.1 469.15,96.25 467,98.4
  LowSpeed 1: 481.8,88.7 v481.8,88.6 | v454.5,98.4 460.2,98.4 467,98.4 475.7,89.7 482.1,89.7 482.8,89 v482.8,88.6 482.8,71.8 483.3,71.3 v483.6,71.3
  other vias: 481.7,71.3 454.3,99.2 452.9,99.3 457.7,98.4 458.1,99.1 451,100.2 451,99.3 457,98.3 482.7,71.3 483.6,88.6
  pour GND1 (isolate 0.1, no thermals): 481.3,72.1 481.3,71 484.3,71 484.3,72.1
  pour LowSpeed (rank 2, no thermals): 481.3,72.1 481.3,70.8 484.3,70.8 484.3,72.1
  pour GND1 (no thermals): 481.5,89 481.5,87.9 484,87.9 484,89
  pour LowSpeed (no thermals): 481.5,89.2 481.5,87.9 484,87.9 484,89.2
  pour GND1 (no thermals): 450.8,98.9 453.4,98.9 454.8,97.5 455.6,97.5 455.6,99.6 453.1,99.6 452.3,100.4 452.3,100.5 450.8,100.5
  pour GND1 (no thermals): 456.8,97.5 456.8,99.5 459.3,99.5 459.3,98.7 459,98.7 457.8,97.5
  pour LowSpeed (no thermals): 450.8,98.9 453.4,98.9 454.8,97.5 459.3,97.5 459.3,99.6 453.1,99.6 452.3,100.4 452.3,100.5 450.8,100.5
AGND  (via drill 0.3, 0.5)
  GND1 0.48: 480.2,87.34 480.47,87.34 480.51,87.3 J32.14
  GND1 0.5: J32.13 v480.6,72.7 | v478.8,79.1
  LowSpeed 0.5: v480.6,72.7 478.8,74.5 v478.8,79.1
  other vias: 31,105 70,61.5 110,61.5 150,61.5 190,61.5 278,60 220,48 140,48 60,48 70,98.5 31,114 413,118 403,118 393,118 383,118 418.3,109.7 411.3,109.7 401.3,109.7 391.3,109.7 381.3,109.7 371.3,109.7 364.3,109.7 359.3,114.7 355.3,118.7 374,121.5 373.7,131.8 354.1,119.9 357.9,116 362.2,111.3 331.2,129.1 350.5,121.4 339.6,120.7 321.2,126.7 316.5,121.3 309,120 294,110 294,98 294,86 294,76 294,67 294,59 294,49 293,139 338.4,143.94 347,144.02 362,144.03 335.6,124.6 324.6,129.2 327,120.5 341,123.4 373.3,143.9 373.9,127.2 373.4,138.8 334.1,120.5 344.6,121.4 322.7,122.1 326.2,125.3 422.8,109.8 426.1,107.9 429.2,104.6 431.9,102.1 433.3,100.4 433.4,96.5 433.4,92.8 433.4,88.8 435.3,86.3 438.1,83.3 441.1,80.3 443,79.2 446.6,79.3 451.3,79.3 456.9,79.4 462.5,79.4 468.4,79.4 474.4,79.5 478.5,87.7 473.5,87.7 466.3,87.8 459,87.7 453.1,87.7 447.3,87.7 443.4,91.5 443.3,96.9 443.2,100.2 441.8,104.4 439,107.4 435.5,110.7 432,114.4 427.7,118.3 421.5,118.2 376.5,118.5 31,95 31,85 31,75 31,65 31,55 31,46 40,46 50,46 60,46 70,46 40,114 50,114 60,114 70,114 80,114 90,114 100,114 110,114 120,114 130,114 140,114 150,114 160,114 170,114 180,114 190,114 200,114 210,114 220,114 230,114 240,114 250,114 260,114 270,117 277,124 80,46 90,46 100,46 110,46 120,46 130,46 140,46 150,46 160,46 170,46 180,46 190,46 200,46 210,46 220,46 230,46 240,46 250,46 260,46 270,46 280,46 290,46 283,130 297.4,142 386.3,109.7 396.3,109.7 406.3,109.7 376.3,109.7 368.3,109.7 374.3,118.7 388.5,118.5 398.5,118.5 408.5,118.5 417.5,118.5 424.5,118.5 430,116.4 434,112.4 437,109.4 443,103.4 443.4,93.5 443.4,95.5 463,87.7 470,87.7 456,87.7 451.1,87.7 454.3,79.3 459.3,79.3 465.5,79.4 471.4,79.4 415.3,109.7 288,135 230,61.5 110,98.5 148,100.5 188,100.5 228,100.5 270,98.5 280,110 302.9,143.9 275.3,91.2 255.4,80.6 228.4,87.5 203.8,80.8 181.4,88.2 140.7,92 106.8,83.3 72.9,90.8 38.6,89.8 37.9,68.5 346.6,130.2 351.5,130.3 363.9,130.4 370.6,123.9 368,129.5 367.4,126.1 339.7,129.5 342.1,129.7 312.1,143.1 317.7,143.5 324.9,143.7 331.6,143.8 371.1,130 370.7,126.7
  pour GND1 (rank 2): 30,115 296,115 296,45 30,45
  pour GND1: 375,119 301,119 295,113 266,114 293,141 293,148 375,148
  pour LowSpeed: 30,115 296,115 296,45 30,45
  pour GND2: 375,119 428,119 444,103 444,90.8 446.8,88 484.2,88 484.2,79.5 481.3,79.5 481.3,79 441.6,79 433,87.6 433,100 424,109 363.3,109 341.6,130.7 341.6,135 375,135
  pour LowSpeed: 353.2,119 301,119 295,113 266,114 293,141 293,148 375,148 375,119 368.8,119 361,111.2
  pour GND1 (isolate 0.1, rank 2): 375,119 428,119 444,103 444,90.8 446.8,88 484.2,88 484.2,79.5 481.3,79.5 481.3,79 441.6,79 433,87.6 433,100 424,109 363.3,109 353,119 353,121 343,131 341.6,134.9 375,135
AIO_0  (via drill 0.3, 0.5)  (1 unrouted)
  GND1 0.2: J32.20 480.72,79.68 v480.7,79.7
  GND1 0.5: v68,105 70,105 D5.C
  HighSpeed 0.2: v480.7,79.7 476,79.7 475.55,80.15 442.85,80.15 434,89 434,101 424.49,110.52 365.38,110.52 353.1,122.8 345.28,122.8 J17.3
  GND2 0.2: J26.2 297.98,139.72 304.6,139.72 304.88,139.44 309.24,139.44 310.3,140.5 313.7,140.5 314.8,141.6 323.9,141.6 325.4,143.1 330.06,143.1 J17.19
  GND2 0.5: 68.3,105 v68,105 | J9.1 v68,105 | v68,105 75,112 267,112 291.37,136.37 J26.2
AIO_1  (via drill 0.3, 0.5)  (1 unrouted)
  GND1 0.2: J32.7 480.22,80.32 v480.2,80.3
  GND1 0.5: D6.C 110,105 v108,105
  HighSpeed 0.2: v480.2,80.3 476.4,80.3 476,80.7 443.3,80.7 434.7,89.3 434.7,101.3 424.85,111.15 365.97,111.15 353.12,124 346.62,124 J17.4 | J26.4 299.9,139.1 309.5,139.1 310.5,140.1 313.9,140.1 314.9,141.1 324,141.1 325.3,142.4 333.3,142.4 J17.20
  GND2 0.2: J26.4 295.9,135.1 293.9,135.1
  GND2 0.5: J10.1 v108,105 115,98 255.5,98 292.6,135.1 293.9,135.1
AIO_2  (via drill 0.3, 0.5)  (1 unrouted)
  GND1 0.2: J32.19 480.75,80.95 v480.7,80.9
  GND1 0.5: v148,105 150,105 D7.C
  HighSpeed 0.2: v480.7,80.9 476.8,80.9 476.3,81.4 443.6,81.4 435.5,89.5 435.5,101.5 425.21,111.78 366.43,111.78 353.22,125 348.16,125 J17.5
  HighSpeed 0.5: J11.1 v148,105 v158,95
  GND2 0.2: 298.4,133 298.4,135.06 J26.6 302.17,138.83 309.83,138.83 310.7,139.7 314,139.7 315,140.7 324.2,140.7 325.4,141.9 328.6,141.9 329.45,141.05 329.45,139.35 329.9,138.9 336.98,138.9 J17.21
  GND2 0.5: v158,95 255,95 292.25,132.25 297.95,132.25 298.4,132.7 298.4,133
AIO_3  (via drill 0.3, 0.5)  (1 unrouted)
  GND1 0.2: J32.6 480.21,81.59 v480.2,81.6
  GND1 0.5: v188,105 190,105 D8.C
  HighSpeed 0.2: v480.2,81.6 476.9,81.6 476.45,82.05 443.95,82.05 436.3,89.7 436.3,101.7 425.58,112.42 367.1,112.42 353.52,126 349.7,126 J17.6 | J26.8 304.34,138.46 310,138.46 310.84,139.3 314.2,139.3 315.2,140.3 324.6,140.3 325.6,141.3 328.5,141.3 329.1,140.7 329.1,139.2 329.7,138.6 339.22,138.6 J17.22
  HighSpeed 0.5: J12.1 v188,105 v201,92
  GND2 0.2: J26.8 301,135.12 301,133
  GND2 0.5: v201,92 254.5,92 293.7,131.2 299.2,131.2 301,133
AIO_4  (via drill 0.3, 0.5)  (1 unrouted)
  GND1 0.2: J32.18 480.72,82.22 v480.7,82.2
  GND1 0.5: v228,105 230,105 D9.C
  HighSpeed 0.2: v480.7,82.2 477.3,82.2 476.9,82.6 444.3,82.6 437.1,89.8 437.1,101.9 425.94,113.06 367.66,113.06 353.66,127.06 351.18,127.06 J17.7
  HighSpeed 0.5: J13.1 v228,105 v244,89
  GND2 0.2: 303.5,133 303.5,135.08 J26.10 306.51,138.09 310.23,138.09 311.07,138.93 314.63,138.93 315.6,139.9 324.4,139.9 326,138.3 341.46,138.3 J17.23
  GND2 0.5: v244,89 254,89 295,130 301.6,130 303.5,131.9 303.5,133
AIO_5  (via drill 0.3, 0.5)  (1 unrouted)
  GND1 0.2: J32.5 480.26,82.86 v480.2,82.8
  GND1 0.5: D10.C 270.5,105 v272,105
  HighSpeed 0.2: v480.2,82.8 477.6,82.8 477.1,83.3 444.6,83.3 437.8,90.1 437.8,102.1 426.29,113.61 368.29,113.61 354,127.9 352.88,127.9 J17.8 | 306.1,133 306.1,135.14 J26.12 308.68,137.72 310.35,137.72 311.17,138.53 314.94,138.53 315.9,139.5 324.3,139.5 325.8,138 343.7,138 J17.24
  HighSpeed 0.5: J14.1 v272,105 296.25,129.25 304.25,129.25 306.1,131.1 306.1,133
AIO_6  (via drill 0.3, 0.5)  (1 unrouted)
  GND1 0.2: J32.17 v480.71,83.49 v480.7,83.5
  GND1 0.5: v68,55 70,55 D11.C
  HighSpeed 0.2: v480.7,83.5 477.9,83.5 477.4,84 444.9,84 438.5,90.4 438.5,102.3 426.48,114.33 369,114.33 J17.9
  GND2 0.2: 308.6,133 308.6,135.1 J26.14 311.7,138.2 315.2,138.2 316.1,139.1 324.1,139.1 325.5,137.7 345.94,137.7 J17.25
  GND2 0.5: J20.1 v68,55 88,75 278.5,75 282,78.5 282,113.5 297,128.5 306.1,128.5 308.6,131 308.6,133
AIO_7  (via drill 0.3, 0.5)  (1 unrouted)
  GND1 0.2: J32.4 480.23,84.13 v480.2,84.1
  GND1 0.5: v108,55 110,55 D12.C
  HighSpeed 0.2: v480.2,84.1 478.3,84.1 477.7,84.7 445.3,84.7 439.2,90.8 439.2,102.5 426.65,115.05 369.5,115.05 350.86,133.69 J17.10 | J26.16 313.92,137.88 315.58,137.88 316.4,138.7 323.9,138.7 325.2,137.4 348.18,137.4 J17.26
  GND2 0.2: J26.16 311.2,135.16 311.2,133
  GND2 0.5: J21.1 v108,55 125,72 279,72 284,77 284,113 298,127 308.1,127 311.2,130.1 311.2,133
AIO_8  (via drill 0.3, 0.5)  (1 unrouted)
  GND1 0.2: J32.16 480.74,84.76 v480.7,84.8
  GND1 0.5: v148,55 150,55 D13.C
  HighSpeed 0.2: v480.7,84.8 478.8,84.8 478.3,85.3 445.8,85.3 439.9,91.2 439.9,102.7 427,115.59 370.5,115.59 353.4,132.69 J17.11
  GND2 0.2: 313.7,133 313.7,135.12 J26.18 316.88,138.3 323.7,138.3 324.9,137.1 350.42,137.1 J17.27
  GND2 0.5: J22.1 v148,55 162,69 280,69 286,75 286,112.5 299,125.5 309.6,125.5 313.7,129.6 313.7,133
AIO_9  (via drill 0.3, 0.5)  (1 unrouted)
  GND1 0.2: J32.3 v480.2,85.4
  GND1 0.5: v188,55 190,55 D14.C
  HighSpeed 0.2: v480.2,85.4 479.3,85.4 478.7,86 446,86 440.8,91.2 440.8,102.7 427.27,116.23 371.5,116.23 355.94,131.79 J17.12 | J26.20 319.01,137.89 323.51,137.89 324.6,136.8 352.66,136.8 J17.28
  GND2 0.2: J26.20 316.3,135.18 316.3,133
  GND2 0.5: J23.1 v188,55 199,66 281,66 288,73 288,112 300,124 310.6,124 316.3,129.7 316.3,133
AIO_10  (via drill 0.3, 0.5)  (1 unrouted)
  GND1 0.2: J32.15 480.77,86.03 v480.7,86.1
  GND1 0.5: v228,55 230,55 D15.C
  HighSpeed 0.2: v480.7,86.1 479.6,86.1 479.1,86.6 446.3,86.6 441.6,91.3 441.6,102.8 427.54,116.86 372.5,116.86 358.48,130.88 J17.13
  GND2 0.2: 318.8,133 318.8,135.14 J26.22 321.16,137.5 323.2,137.5 324.2,136.5 354.9,136.5 J17.29
  GND2 0.5: J24.1 v228,55 236,63 282,63 290,71 290,111.5 301,122.5 311.6,122.5 318.8,129.7 318.8,133
AIO_11  (via drill 0.3, 0.5)  (1 unrouted)
  GND1 0.2: J32.2 480.23,86.67 v480.2,86.7
  GND1 0.5: v278,55 280,55 D16.C
  HighSpeed 0.2: v480.2,86.7 479.7,87.2 446.5,87.2 442.4,91.3 442.4,103 427.9,117.5 373.5,117.5 361.02,129.98 J17.14 359.82,136.2 322.74,136.2 J26.24
  GND2 0.2: J26.24 321.3,135.1 321.3,133.2
  GND2 0.5: J25.1 v278,55 280,55 292,67 292,111 302,121 312.6,121 321.3,129.7 321.3,133.2
BUTTON0  (via drill 0.3)
  GND1 0.2: U50.16 450.43,68.28 v450.4,68.3
  HighSpeed 0.2: v450.4,68.3 449.7,68.3 447.41,70.59 442.01,70.59 427.8,84.8 386.9,84.8 384.46,87.24 S5.SW1
BUTTON1  (via drill 0.3)
  GND1 0.2: U50.17 450.82,68.92 v450.8,68.9
  HighSpeed 0.2: v450.8,68.9 449.8,68.9 447.2,71.5 442.1,71.5 428.1,85.5 406.9,85.5 404.46,87.94 S7.SW1
BUTTON2  (via drill 0.3)
  GND1 0.2: U50.18 450.52,69.58 v450.5,69.6
  HighSpeed 0.2: v450.5,69.6 450,69.6 446.7,72.9 441.9,72.9 428.6,86.2 426.4,86.2 424.46,88.14 S9.SW1
BUTTON3  (via drill 0.3)
  GND1 0.2: v445.1,66.38 445.72,67 446.6,67 446.57,66.97 U50.11
  HighSpeed 0.2: S6.SW1 384.46,69.64 385.85,68.25 437.75,68.25 439.61,66.39 v445.1,66.39 v445.1,66.38
BUTTON4  (via drill 0.3)
  GND1 0.2: U50.14 450.82,66.97 v450.8,67
  HighSpeed 0.2: S8.SW1 404.46,69.94 405.2,69.2 438.1,69.2 440.3,67 v450.8,67
BUTTON5  (via drill 0.3)
  GND1 0.2: U50.10 443.37,67.62 v443,68
  HighSpeed 0.2: S10.SW1 424.87,72.6 437.1,72.6 441.7,68 v443,68
DIN0  (via drill 0.3)  (1 unrouted)
  GND1 0.2: R42.2 v440.7,117.4 | D30.4 v434.4,121.1
  HighSpeed 0.2: v440.7,117.4 438.1,117.4 v434.4,121.1 433.1,122.4 415.89,122.4 J35.2 | J35.11 400.47,142.9 394.7,142.9 390.8,139 380.19,139 J34.2
DIN0_P  (via drill 0.3)
  GND1 0.2: R42.1 D34.3 v445.7,116.5
  HighSpeed 0.2: U49.14 456.32,113.68 455.1,114.9 447.3,114.9 v445.7,116.5
DIN1  (via drill 0.3)
  GND1 0.2: v449.2,118.4 449.86,117.74 R34.2 | D30.3 v433.9,122.8
  HighSpeed 0.2: J35.12 J35.3 416.93,123.9 433.6,123.9 433.95,123.55 | v449.2,118.4 439.1,118.4 433.95,123.55 | v433.9,122.8 433.9,123.5 433.95,123.55
  LowSpeed 0.2: J35.12 405.83,141.52 404.84,142.51 389.9,142.51 386.8,139.41 383.13,139.41 J34.4
DIN1_P  (via drill 0.3)
  GND1 0.2: R34.1 D25.3 v454.8,117.4
  HighSpeed 0.2: v454.8,117.4 458.31,117.4 U49.15
DIN2  (via drill 0.3)  (1 unrouted)
  GND1 0.2: R40.2 v440.7,121.4 | D30.2 v433.4,125.2
  HighSpeed 0.2: v440.7,121.4 438.4,121.4 434.6,125.2 v433.4,125.2 418.17,125.2 J35.4
  LowSpeed 0.2: J35.4 404.55,138.82 404.55,140.9 403.81,141.64 390,141.64 386.86,138.5 384.8,138.5 382.67,136.37 J34.6
DIN2_P  (via drill 0.3)
  GND1 0.2: D32.3 R40.1 | 445.8,121.4 D32.3 | v445.7,120.4 D32.3
  HighSpeed 0.2: U49.16 459.12,119.12 453.18,119.12 451.6,120.7 446.4,120.7 446.1,120.4 v445.7,120.4
DIN3  (via drill 0.3)  (1 unrouted)
  GND1 0.2: v449.2,122.4 449.86,121.74 R32.2 | D30.1 v432.9,126.58
  HighSpeed 0.2: v449.2,122.4 439.28,122.4 435.1,126.58 v432.9,126.58 419.33,126.58 J35.5
  LowSpeed 0.2: J35.5 409.71,133.8 404.95,133.8 404.55,134.2 404.55,135.8 401.71,138.64 400.29,138.64 398.11,140.82 390.5,140.82 387.43,137.75 386.56,137.75 J34.8
DIN3_P  (via drill 0.3)
  GND1 0.2: R32.1 D23.3 v454.8,121.4
  HighSpeed 0.2: v454.8,121.4 462.13,121.4 463.83,123.1 465.5,123.1 469.65,127.25 U49.9
DIN4  (via drill 0.3)  (1 unrouted)
  GND1 0.2: R38.2 v440.7,125.4 | D30.10 v432.9,127.4
  HighSpeed 0.2: 432.9,127.95 420.5,127.95 J35.6 | 432.9,127.95 435.65,127.95 438.2,125.4 v440.7,125.4 | v432.9,127.4 432.9,127.95
  LowSpeed 0.2: J35.6 411.55,133.1 400.1,133.1 398.6,134.6 398.6,137.6 396.3,139.9 391.25,139.9 J34.10
DIN4_P  (via drill 0.3)
  GND1 0.2: R38.1 D29.3 v445.7,124.6
  HighSpeed 0.2: U49.10 461.99,123.8 446.5,123.8 v445.7,124.6
DIN5  (via drill 0.3)  (1 unrouted)
  GND1 0.2: v449.2,126.4 449.86,125.74 R30.2 | D30.9 v433.4,129.7
  HighSpeed 0.2: 433.4,129.32 421.67,129.32 J35.7 | 433.4,129.32 436.28,129.32 439.2,126.4 v449.2,126.4 | v433.4,129.7 433.4,129.32
  LowSpeed 0.2: J35.7 413.29,132.3 398.75,132.3 397.48,133.57 397.48,136.93 395.52,138.88 392.77,138.88 J34.12
DIN5_P  (via drill 0.3)
  GND1 0.2: R30.1 D20.3 v454.8,125.4
  HighSpeed 0.2: v454.8,125.4 461.05,125.4 U49.11
DIN6  (via drill 0.3)  (1 unrouted)
  GND1 0.2: R36.2 v440.8,129.4 | D30.7 v434.4,130.79
  HighSpeed 0.2: v440.8,129.4 438.2,129.4 436.81,130.79 v434.4,130.79 422.74,130.79 J35.8
  LowSpeed 0.2: J35.8 414.83,131.3 398.45,131.3 396.6,133.15 396.6,137 395.6,138 394.43,138 J34.14
DIN6_P  (via drill 0.3)
  GND1 0.2: R36.1 D27.3 v445.7,128.6
  HighSpeed 0.2: U49.12 460.56,127.44 454.75,127.44 454.3,127.9 446.4,127.9 v445.7,128.6
DIN7  (via drill 0.3)  (1 unrouted)
  GND1 0.2: R28.2 449.86,130.34 v449.5,130.7 | D30.6 v434.9,131.8
  HighSpeed 0.2: J35.9 424.27,131.8 v434.9,131.8 439.5,131.8 439.51,131.81 448.39,131.81 v449.5,130.7
  LowSpeed 0.2: J35.9 416.28,130.21 396.4,130.21 394.15,132.46 394.15,135.19 J34.16
DIN7_P  (via drill 0.3)
  GND1 0.2: R28.1 D18.3 v454.8,129.4
  HighSpeed 0.2: v454.8,129.4 459.01,129.4 U49.13
DOUT0  (via drill 0.3)  (1 unrouted)
  GND1 0.2: R27.2 463.8,126.3 463.8,125.8 v463.1,125.8 | D21.10 v436.9,129.5
  HighSpeed 0.2: v463.1,130.4 458.5,135 J33.2
  LowSpeed 0.2: v463.1,125.8 v463.1,130.4 | J33.11 457.02,141.4 444.7,141.4 441.8,138.5 434.74,138.5 J31.2 431.3,135.06 431.3,132.8 433.9,130.2 436.2,130.2 v436.9,129.5
DOUT0_P
  GND1 0.2: D17.3 466.7,124.5 466,125.2 466,126.3 R27.1 465.94,127.24 466.5,127.8 470.1,127.8 471.22,128.92 U49.8
DOUT1  (via drill 0.3)  (1 unrouted)
  GND1 0.2: R29.2 467.6,126.3 v468.2,126.9 | D21.9 437.4,127.5 v437.3,127.4
  HighSpeed 0.2: J33.3 465.38,130.5 467.5,130.5 468.2,129.8 v468.2,126.9 | J31.4 437.98,139.2 v438,139.2
  LowSpeed 0.2: 468.3,127 v468.2,126.9 | J33.12 457.96,143 444.7,143 440.9,139.2 v438,139.2 | v437.3,127.4 437.7,127.8 437.7,129.8 435,132.5 434.6,132.5 433.9,133.2 433.9,135.12 J31.4
DOUT1_P
  GND1 0.2: 474.3,128.49 U49.7 474.12,128.92 472.7,127.5 470.4,127.5 470.2,127.3 469.7,127.3 469.54,127.14 R29.1 469.54,125.26 470.3,124.5 D19.3
DOUT2  (via drill 0.3)  (1 unrouted)
  GND1 0.2: v471.9,126.4 471.16,126.4 R31.2 | D21.7 v438.4,129.9
  HighSpeed 0.2: v471.9,126.4 471.1,127.2 471.1,129.5 469.4,131.2 467.22,131.2 J33.4 | J33.13 461.7,141.8 444.2,141.8 440.29,137.89 439.21,137.89 J31.6
  LowSpeed 0.2: J31.6 436.46,135.14 436.46,133.15 438.4,131.21 v438.4,129.9
DOUT2_P
  GND1 0.2: 473.9,124.2 D22.3 473.8,124.4 473.8,124.6 473.14,125.26 R31.1 | 473.2,126.24 R31.1 | 477.14,128.79 U49.6 475.9,127.55 473.75,127.55 473.14,126.94 R31.1
DOUT3  (via drill 0.3)  (1 unrouted)
  GND1 0.2: R33.2 v475.5,126.3 | D21.6 v438.9,127.5
  HighSpeed 0.2: v475.5,126.3 473.4,128.4 473.4,129.7 471.2,131.9 469.06,131.9 J33.5 | J33.14 464.58,138.7 442.56,138.7 J31.8
  LowSpeed 0.2: J31.8 439.08,135.22 439.08,132 438.9,131.82 v438.9,127.5
DOUT3_P
  GND1 0.2: D24.3 477.5,124.6 476.74,125.36 R33.1 476.74,127.04 477.45,127.75 478.64,127.75 U49.5
DOUT4  (via drill 0.3)  (1 unrouted)
  GND1 0.2: R35.2 v479.2,126.3 | D21.1 v436.9,125.4 v436.91,125.41
  HighSpeed 0.2: v479.2,126.3 478.1,126.3 475.9,128.5 475.9,129.9 473.1,132.7 470.8,132.7 J33.6 | J33.15 466.22,137.8 444.2,137.8 J31.10
  LowSpeed 0.2: v436.91,125.41 437.95,126.45 438.09,126.45 438.75,126.45 439.6,127.3 439.6,129 441.5,130.9 441.5,135.1 J31.10
DOUT4_P
  GND1 0.2: D26.3 481.1,124.6 480.4,125.3 480.4,126.24 R35.1 480.34,126.91 U49.4
DOUT5  (via drill 0.3)  (1 unrouted)
  GND1 0.2: v482.7,126.3 R37.2 | D21.2 437.4,124.6 v437.6,124.8
  HighSpeed 0.2: v482.7,126.3 480.7,126.3 478.6,128.4 478.6,130.9 476.1,133.4 472.64,133.4 J33.7
  LowSpeed 0.2: J33.7 469.44,133.4 455,133.4 453.5,134.9 453.5,137 451.3,139.2 446.3,139.2 445.31,138.21 J31.12 445.31,136.01 444,134.7 444,131.34 440.3,127.64 440.3,127.2 438.9,125.8 438.6,125.8 v437.6,124.8
DOUT5_P
  GND1 0.2: D28.3 484.7,125.54 R37.1 | 483.71,126.3 R37.1 | R37.1 483.94,127.97 U49.3
DOUT6  (via drill 0.3)  (1 unrouted)
  GND1 0.2: v486.3,126.3 R39.2 | D21.3 437.9,124.3 438.4,124.8 v438.9,124.8
  HighSpeed 0.2: v486.3,126.3 485.1,126.3 483.6,127.8 483.6,130.06 J33.17
  LowSpeed 0.2: J33.8 471.28,132.7 454.4,132.7 452.3,134.8 452.3,136.6 450.75,138.15 448.45,138.15 447.85,137.55 J31.14 446.6,135.12 446.6,133.2 446,132.6 446,131.1 441.65,126.75 440.85,126.75 v438.9,124.8
DOUT6_P
  GND1 0.19: R39.1 487.54,126.2 487.54,125.06 488.2,124.4
  GND1 0.2: 488.2,124.4 D31.3 | U49.2 487.43,126.31 487.54,126.2
DOUT7  (via drill 0.3)  (1 unrouted)
  GND1 0.2: v489.9,126.3 R41.2 | D21.4 438.4,122.9 v438.2,122.7
  HighSpeed 0.2: v489.9,126.3 488.8,127.4 488.8,129.68 478.4,140.08 J33.18
  LowSpeed 0.2: J33.9 473.12,132 449.1,132 | v438.2,122.7 440.2,124.7 441,124.7 448.3,132 449.1,132 | J31.16 449.1,135.08 449.1,132
DOUT7_P
  GND1 0.2: U49.1 489.97,127.47 R41.1 491.14,125.06 D33.3
GND  (via drill 0.3, 0.5)
  GND1 0.2: U51.15 U51.14 | v449.9,96.3 450,96.2 R19.2 | v449.9,95 450.2,94.7 R20.2 | U50.2 447.93,72.83 448.9,73.8 448.9,74.87 C43.1 | v476.8,110.1 C49.2 | C48.2 v476.8,105.3 | C46.2 v471,105.6 | v467.1,109.9 467.62,109.9 U52.4 | v472.9,109.9 473.32,109.9 U53.4 | D18.1 455.9,128.4 | 455.9,124.4 D20.1 | D23.1 455.9,120.5 | D30.5 434.9,123.3 v435.4,123.3 | C47.2 470.97,109.63 v470.4,110.2
  GND1 0.254: U47.B5 U47.C5 U47.D5 | U47.C2 U47.C1
  GND1 0.3: U51.14 C44.2 v476.2,118.2 | C45.2 v477.6,118.2 | v475.9,115.9 475.88,115.92 U51.9 U51.10 | U48.4 489.8,119.8 490.4,119.2 C42.1 491.27,118.53 v491.3,118.5 | v468.5,115.5 468.5,115.72 U51.8
  GND1 0.5: C43.1 v447.8,74.9 | 487.9,87.3 489.8,89.2 | U48.4
  GND2 0.5: 487.9,87.3 489.8,89.2